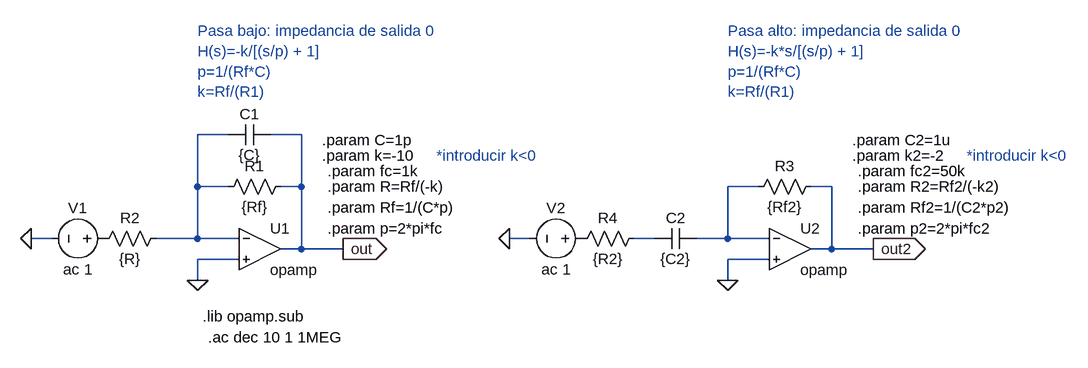
[diagram p0: schematic paracascada.asc]
paracascada.asc, the LTspice schematic file:
Version 4
SHEET 1 1480 680
WIRE 160 -16 112 -16
WIRE 272 -16 224 -16
WIRE 112 64 112 -16
WIRE 160 64 112 64
WIRE 272 64 272 -16
WIRE 272 64 240 64
WIRE 976 64 928 64
WIRE 1088 64 1056 64
WIRE -112 144 -144 144
WIRE 112 144 112 64
WIRE 112 144 48 144
WIRE 176 144 112 144
WIRE 624 144 592 144
WIRE 816 144 784 144
WIRE 928 144 928 64
WIRE 928 144 880 144
WIRE 992 144 928 144
WIRE 272 160 272 64
WIRE 272 160 240 160
WIRE 336 160 272 160
WIRE 1088 160 1088 64
WIRE 1088 160 1056 160
WIRE 1152 160 1088 160
WIRE 176 176 112 176
WIRE 992 176 928 176
WIRE 112 208 112 176
WIRE 928 208 928 176
FLAG 112 208 0
FLAG -144 144 0
FLAG 336 160 out
IOPIN 336 160 Out
FLAG 928 208 0
FLAG 592 144 0
FLAG 1152 160 out2
IOPIN 1152 160 Out
SYMBOL OpAmps\\opamp 208 96 R0
SYMATTR InstName U1
SYMBOL cap 224 -32 R90
WINDOW 0 0 32 VBottom 2
WINDOW 3 32 32 VTop 2
SYMATTR InstName C1
SYMATTR Value {C}
SYMBOL res 256 48 R90
WINDOW 0 0 56 VBottom 2
WINDOW 3 32 56 VTop 2
SYMATTR InstName R1
SYMATTR Value {Rf}
SYMBOL res 64 128 R90
WINDOW 0 0 56 VBottom 2
WINDOW 3 32 56 VTop 2
SYMATTR InstName R2
SYMATTR Value {R}
SYMBOL voltage -16 144 R90
WINDOW 0 -32 56 VBottom 2
WINDOW 3 32 56 VTop 2
SYMATTR InstName V1
SYMATTR Value ac 1
SYMBOL OpAmps\\opamp 1024 96 R0
SYMATTR InstName U2
SYMATTR SpiceLine Aol=100MEG
SYMATTR SpiceLine2 GBW=1000Meg
SYMBOL cap 880 128 R90
WINDOW 0 0 32 VBottom 2
WINDOW 3 32 32 VTop 2
SYMATTR InstName C2
SYMATTR Value {C2}
SYMBOL res 1072 48 R90
WINDOW 0 0 56 VBottom 2
WINDOW 3 32 56 VTop 2
SYMATTR InstName R3
SYMATTR Value {Rf2}
SYMBOL res 800 128 R90
WINDOW 0 0 56 VBottom 2
WINDOW 3 32 56 VTop 2
SYMATTR InstName R4
SYMATTR Value {R2}
SYMBOL voltage 720 144 R90
WINDOW 0 -32 56 VBottom 2
WINDOW 3 32 56 VTop 2
SYMATTR InstName V2
SYMATTR Value ac 1
TEXT 120 264 Left 2 !.lib opamp.sub
TEXT 112 -176 Left 2 ;Pasa bajo: impedancia de salida 0\nH(s)=-k/[(s/p) + 1]\np=1/(Rf*C)\nk=Rf/(R1)
TEXT 304 -8 Left 2 !.param C=1p
TEXT 312 64 Left 2 !.param R=Rf/(-k)
TEXT 312 96 Left 2 !.param Rf=1/(C*p)
TEXT 304 16 Left 2 !.param k=-10
TEXT 128 296 Left 2 !.ac dec 10 1 1MEG
TEXT 480 16 Left 2 ;*introducir k<0
TEXT 312 128 Left 2 !.param p=2*pi*fc
TEXT 312 40 Left 2 !.param fc=1k
TEXT 928 -176 Left 2 ;Pasa alto: impedancia de salida 0\nH(s)=-k*s/[(s/p) + 1]\np=1/(Rf*C)\nk=Rf/(R1)
TEXT 1120 -8 Left 2 !.param C2=1u
TEXT 1128 64 Left 2 !.param R2=Rf2/(-k2)
TEXT 1128 96 Left 2 !.param Rf2=1/(C2*p2)
TEXT 1120 16 Left 2 !.param k2=-2
TEXT 1296 16 Left 2 ;*introducir k<0
TEXT 1128 128 Left 2 !.param p2=2*pi*fc2
TEXT 1128 40 Left 2 !.param fc2=50k

The netlist it stands for:
* paracascada.asc
XU1 N001 0 out opamp Aol=100K GBW=10Meg  ; pins invin noninvin out
C1 out N001 {C}
R1 out N001 {Rf}
R2 N001 P001 {R}
V1 P001 0 ac 1
XU2 N002 0 out2 opamp Aol=100MEG GBW=1000Meg  ; pins invin noninvin out
C2 N002 N003 {C2}
R3 out2 N002 {Rf2}
R4 N003 P002 {R2}
V2 P002 0 ac 1
.lib opamp.sub
* Pasa bajo: impedancia de salida 0
* H(s)=-k/[(s/p) + 1]
* p=1/(Rf*C)
* k=Rf/(R1)
.param C=1p
.param R=Rf/(-k)
.param Rf=1/(C*p)
.param k=-10
.ac dec 10 1 1MEG
* *introducir k<0
.param p=2*pi*fc
.param fc=1k
* Pasa alto: impedancia de salida 0
* H(s)=-k*s/[(s/p) + 1]
* p=1/(Rf*C)
* k=Rf/(R1)
.param C2=1u
.param R2=Rf2/(-k2)
.param Rf2=1/(C2*p2)
.param k2=-2
* *introducir k<0
.param p2=2*pi*fc2
.param fc2=50k
.backanno
.end